# Altium schematic sheet Power_Supplies.SchDoc
size Letter; SheetNumber: 1; SheetTotal: 2
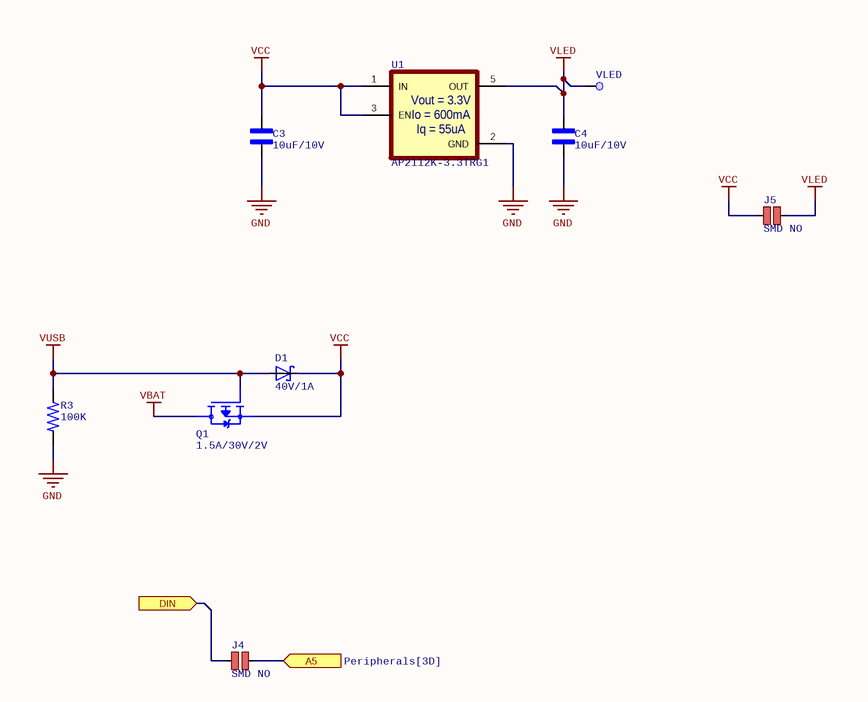
[diagram p0: Power_Supplies.SchDoc]

## Parts
C3  10uF/10V  [C0603]
C4  10uF/10V  [C0603]
D1  40V/1A  [SMA-2]
J4  SMD NO  [JUMPER_SMD_NO]  (net tie, no BOM)
J5  SMD NO  [JUMPER_SMD_NO]  (net tie, no BOM)
Q1  1.5A/30V/2V  [SOT-23-3]
R3  100K  [R0603]
U1  AP2112K-3.3TRG1  [SOT-25-5]
VLED  Test point 1.2mm  [TEST_POINT_1.2MM]  (value not drawn)  (no BOM)

## Ports
A5 (in, see Peripherals[3D]), DIN (in, see Peripherals[1C])

## Nets
GND: C3.2 C4.2 R3.2 U1.2(GND)
VBAT: Q1.3(D)
VCC: C3.1 D1.K J5.1 Q1.2(S) U1.1(IN) U1.3(EN)
VLED: C4.1 J5.2 U1.5(OUT) VLED.1
VUSB: D1.A Q1.1(G) R3.1
A5: J4.2 ; port A5
DIN: J4.1 ; port DIN

## Notes on the sheet
- (in symbol AP2112K-3.3TRG1) Vout = 3.3V; Io = 600mA; Iq = 55uA

## Library data of the parts
C3 C4 = C0603 10uF/10V: MLCC 10uF 10V X5R 20% 0603; Manufacturer: Samsung; Manufacturer Part Number: CL10A106MP8NNND; Supplier 1: Mouser; Supplier Part Number 1: 187-CL10A106MP8NNND; RoHS: Yes; Category: Ceramic Capacitors; Stock 1: 58774; Pricing 1: 1=0.20000, 10=0.14000, 50=0.14000, 100=0.06600, 1000=0.03900, 10000=0.03000 (USD); Supplier 2: Mouser; Supplier Part Number 2: 963-LMK107BBJ106MAHT; RoHS Compliant: Yes
D1 = SS14: SS14 Series 500 mV 1 A 40 V Max Reverse Voltage Schottky Rectifier - DO-214AC; Manufacturer: ON Semiconductor / Fairchild; Max Repetitive Reverse Voltage (Vrrm): 40V; Max Forward Surge Current (Ifsm): 40A; Average Rectified Current: 1A; Max Reverse Current: 200uA; Forward Voltage: 500mV; Polarity: Standard; Supplier 1: Mouser; Supplier Part Number 1: 512-SS14; Manufacturer Part Number: SS14; RoHS: Yes; Category: Schottky Diodes; Stock 1: 331320; Pricing 1: 1=0.37, 10=0.261, 50=0.261, 100=0.117, 1000=0.082, 10000=0.075 (USD); Mount: Surface Mount; Case/Package: DO-214AC; Number of Pins: 2; Weight: 0.003739oz; Min Operating Temperature: -65°C; Max Operating Temperature: 125°C; Packaging: Tape and Reel; Series: -; Package Quantity: 7500; Termination: SMD/SMT; Voltage Rating (DC): 40V; Max Reverse Voltage (DC): 40V; Forward Current: 1A; Peak Non-Repetitive Surge Current: 40A; Current Rating: 1A; Output Current: 1A; Current: 1A; Voltage: 40V; Length: 4.75mm; Width: 2.95mm; Height: 2.2mm; Radiation Hardening: No; RoHS Compliant: Yes; Reach SVHC Compliant: No; ComponentLink1URL: https://datasheet.ciiva.com/4713/ss14-197224-4713938.pdf?src-supplier=Mouser; ComponentLink1Description: https://datasheet.ciiva.com/4713/ss14-197224-4713938.pdf?src-supplier=Mouser; ComponentLink2URL: https://datasheet.ciiva.com/7965/1766303-7965241.pdf?src-supplier=Element14; ComponentLink2Description: https://datasheet.ciiva.com/7965/1766303-7965241.pdf?src-supplier=Element14; ComponentLink3URL: https://datasheet.ciiva.com/22651/1880990-22651980.pdf?src-supplier=Element14; ComponentLink3Description: https://datasheet.ciiva.com/22651/1880990-22651980.pdf?src-supplier=Element14; ComponentLink4URL: https://datasheet.ciiva.com/8303/ss19-8303766.pdf?src-supplier=Avnet; ComponentLink4Description: https://datasheet.ciiva.com/8303/ss19-8303766.pdf?src-supplier=Avnet; ComponentLink5URL: https://datasheet.ciiva.com/910/ss12-910696.pdf?src-supplier=Digikey; ComponentLink5Description: https://datasheet.ciiva.com/910/ss12-910696.pdf?src-supplier=Digikey; ComponentLink6URL: https://datasheet.ciiva.com/910/ss12-910697.pdf?src-supplier=Digikey; ComponentLink6Description: https://datasheet.ciiva.com/910/ss12-910697.pdf?src-supplier=Digikey; ComponentLink7URL: https://datasheet.ciiva.com/910/ss12-910695.pdf?src-supplier=Digikey; ComponentLink7Description: https://datasheet.ciiva.com/910/ss12-910695.pdf?src-supplier=Digikey
J4 J5 = JUMPER_SMD_NO: Rule: UNIONINDEX=0|RULEKIND=ShortCircuit|NETSCOPE=AnyNet|LAYERKIND=SameLayer|NAME=Schematic Short-Circuit Constraint|ALLOWED=TRUE|UNIT=Imperial
Q1 = MOSFET P-CH 30V/1.5A BSS314: MOSFET P-Ch -30V -1.5A SOT-23-3; Manufacturer: Infineon; Manufacturer Part Number: BSS314PE; Supplier 1: Mouser; Supplier Part Number 1: 726-BSS314PEH6327; RoHS: Yes; Stock 1: 2505; Pricing 1: 1=0.46000, 10=0.34700, 50=0.34700, 100=0.21700, 500=0.14800, 1000=0.11400, 3000=0.10200, 6000=0.09600, 9000=0.09400, 10000=0.09400 (USD); Number of Pins: 3; Packaging: Tape and Reel; RoHS Compliant: Yes; Halogen Free: Halogen Free; Supplier 2: Mouser; Supplier Part Number 2: 726-BSS314PEH6327XTS
R3 = R0603 100K: RES 0603 100K OHM 1% 1/10W; Manufacturer: Yageo; Manufacturer Part Number: RC0603FR-07100KL; Resistance: 100kR; Temperature Coefficient: 100ppm/°C; Power Rating: 100mW; Voltage Rating: 50V; Working Voltage: 75V; Supplier 1: Mouser; Supplier Part Number 1: 603-RC0603FR-07100KL; RoHS: Yes; Category: Chip SMD Resistors; Stock 1: 4536807; Case/Package: 0603; Case Code (Imperial): 0603; Case Code (Metric): 1608; Min Operating Temperature: -55°C; Max Operating Temperature: 155°C; Tolerance: 1%; Packaging: Tape and Reel; Length: 1.6mm; Pricing 1: 1=0.10000, 10=0.02100, 100=0.00900, 1000=0.00400, 5000=0.00300, 10000=0.00200 (USD); Resistor Type: Thick Film; Number of Pins: 2; Termination: SMD/SMT; Voltage Rating (DC): 50V; Depth: 0.8mm; REACH SVHC: No SVHC; Military Standard: Not; Lead Free: Lead Free; Number of Terminations: 2; Height: 0.45mm; Width: 0.8mm
U1 = AP2112K-3.3TRG1: IC REG LINEAR 3.3V 600MA SOT25; Manufacturer: Diodes; Min Input Voltage: 2.5V; Number of Outputs: 1; Dropout Voltage: 250mV; Max Input Voltage: 6V; Quiescent Current: 55uA; Polarity: Positive; Accuracy: 1.5%; Output Type: Fixed; Supplier 1: Mouser; Supplier Part Number 1: 621-AP2112K-3.3TRG1; Manufacturer Part Number: AP2112K-3.3TRG1; RoHS: Yes; Category: Voltage Regulators - Linear; Stock 1: 4864; Pricing 1: 1=0.47000, 10=0.31700, 50=0.31700, 100=0.15000, 1000=0.11600, 10000=0.08900 (USD); Mount: Surface Mount; Case/Package: SOT-23-5; Number of Pins: 5; Min Operating Temperature: -40°C; Max Operating Temperature: 85°C; Package Quantity: 1; Packaging: Tape and Reel; Output Voltage: 3.3V; Output Current: 600mA; Number of Regulators: 1; Max Output Current: 600mA; Length: 3.1mm; Width: 1.7mm; Height: 1.3mm; Lead Free: Lead Free; RoHS Compliant: Yes; ComponentLink1URL: https://datasheet.ciiva.com/29569/ap2112-29569917.pdf?src-supplier=Digi-Key; ComponentLink1Description: https://datasheet.ciiva.com/29569/ap2112-29569917.pdf?src-supplier=Digi-Key; ComponentLink2URL: https://datasheet.ciiva.com/29569/ap2112-29569918.pdf?src-supplier=Digi-Key; ComponentLink2Description: https://datasheet.ciiva.com/29569/ap2112-29569918.pdf?src-supplier=Digi-Key; ComponentLink3URL: https://datasheet.ciiva.com/29569/ap2112-29569919.pdf?src-supplier=Digi-Key; ComponentLink3Description: https://datasheet.ciiva.com/29569/ap2112-29569919.pdf?src-supplier=Digi-Key; ComponentLink4URL: https://datasheet.ciiva.com/30016/ap2112-30016792.pdf?src-supplier=Avnet; ComponentLink4Description: https://datasheet.ciiva.com/30016/ap2112-30016792.pdf?src-supplier=Avnet
VLED = Test point: SMD test point